# Altium schematic sheet esp32_pico_d4_motor_driver.SchDoc_2022-05-04 (1).schdoc
size 385 x 195 mm
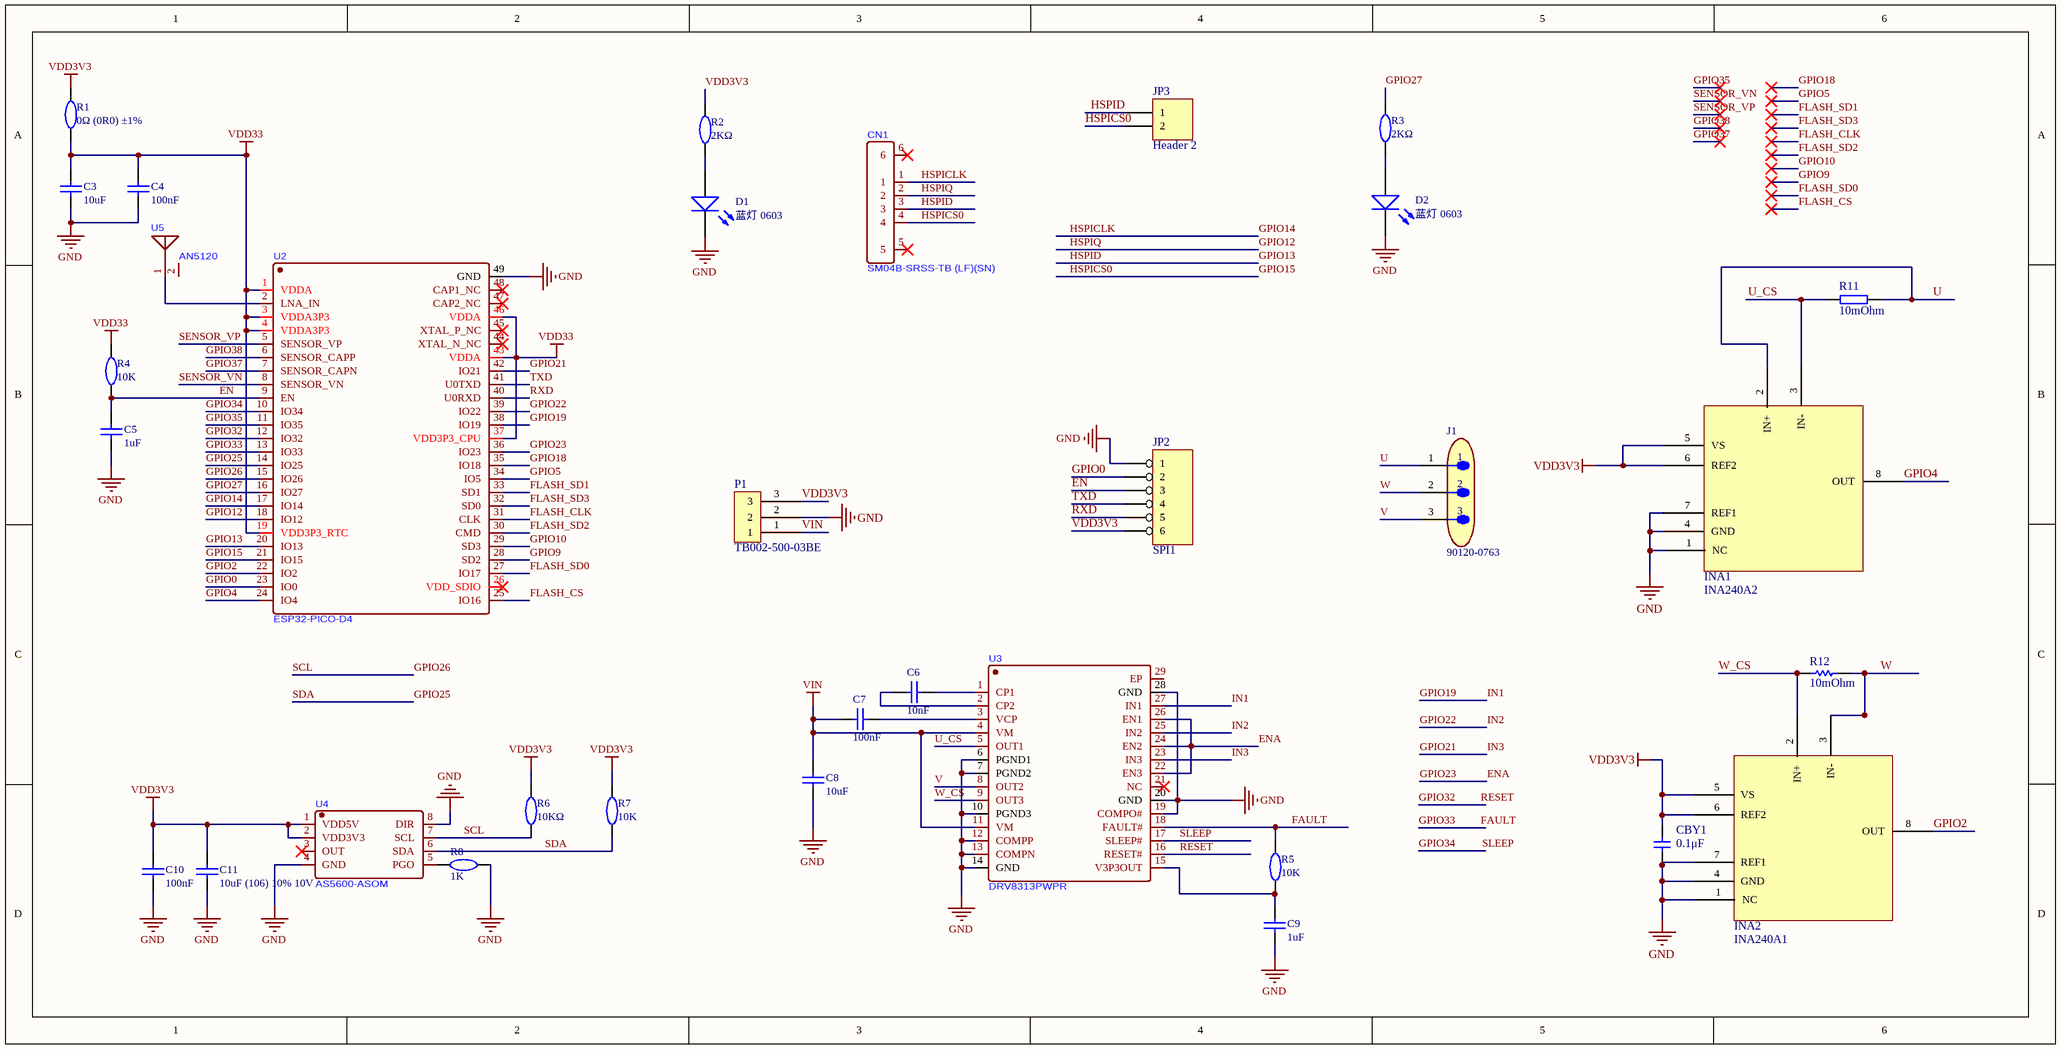
[diagram p0: esp32_pico_d4_motor_driver.SchDoc_2022-05-04 (1).schdoc]

## Parts
C3  10uF  [0603C]
C4  100nF  [0603C]
C5  1uF  [0603C]
C6  10nF  [0603C]
C7  100nF  [0603C]
C8  10uF  [0603C]
C9  1uF  [0603C]
C10  100nF  [0603C]
C11  10uF (106) 10% 10V  [0603C]
CBY1  0.1μF  [0603C]
CN1  SM04B-SRSS-TB (LF)(SN)  [CONN-SMD_4P-P1.00_SM04B-SRSS-TB-LF-SN]
D1  蓝灯 0603  [0603_diode]
D2  蓝灯 0603  [0603_diode]
INA1  INA240A2  [INA240]
INA2  INA240A1  [INA240]
J1  90120-0763  [10.7MHZ]
JP2  SPI1  [SHDR6]
JP3  Header 2  [SHDR2]
P1  TB002-500-03BE  [SHDR3]
R1  0Ω (0R0) ±1%  [0603R]
R2  2KΩ  [0603R]
R3  2KΩ  [0603R]
R4  10K  [0603R]
R5  10K  [0603R]
R6  10KΩ  [0603]
R7  10K  [0603R]
R8  1K  [0603]
R11  10mOhm  [RESC6332]
R12  10mOhm  [RESC6332]
U2  ESP32-PICO-D4  [QFN-48_L7.0-W7.0-P0.50-BL-EP5.4]
U3  DRV8313PWPR  [HTSSOP-28_L9.8-W4.5-P0.65-LS6.6-BL-EP]
U4  AS5600-ASOM  [SOIC-8_L5.0-W4.0-P1.27-LS6.0-BL]
U5  AN5120  [ANT-SMD_L5.5-W2.0]

## Nets
GND: C3.1 C4.1 C5.1 C8.1 C9.1 C10.1 C11.1 CBY1.2 D1.K D2.K INA1.1(NC) INA1.4(GND) INA1.7(REF1) INA2.1(NC) INA2.4(GND) INA2.7(REF1) JP2.1 P1.2 R8.2 U2.49(GND) U3.6(PGND1) U3.7(PGND2) U3.10(PGND3) U3.12(COMPP) U3.13(COMPN) U3.14(GND) U3.19(COMPO#) U3.20(GND) U3.28(GND) U4.4(GND) U4.8(DIR)
VDD3V3: C10.2 C11.2 CBY1.1 INA1.5(VS) INA1.6(REF2) INA2.5(VS) INA2.6(REF2) JP2.6 P1.3 R1.2 R2.2 R6.2 R7.2 U4.1(VDD5V) U4.2(VDD3V3)
VDD33: C3.2 C4.2 R1.1 R4.2 U2.1(VDDA) U2.3(VDDA3P3) U2.4(VDDA3P3) U2.19(VDD3P3_RTC) U2.37(VDD3P3_CPU) U2.43(VDDA) U2.46(VDDA)
VIN: C7.2 C8.2 P1.1 U3.4(VM) U3.11(VM)
EN: C5.2 JP2.3 R4.1 U2.9(EN)
ENA: U2.36(IO23) U3.22(EN3) U3.24(EN2) U3.26(EN1)  [also labelled GPIO23]
FAULT: R5.2 U2.13(IO33) U3.18(FAULT#)  [also labelled GPIO33]
FLASH_CLK: U2.31(CLK)
FLASH_CS: U2.25(IO16)
FLASH_SD0: U2.27(IO17)
FLASH_SD1: U2.33(SD1)
FLASH_SD2: U2.30(CMD)
FLASH_SD3: U2.32(SD0)
GPIO0: JP2.2 U2.23(IO0)
GPIO2: INA2.8(OUT) U2.22(IO2)
GPIO4: INA1.8(OUT) U2.24(IO4)
GPIO5: U2.34(IO5)
GPIO9: U2.28(SD2)
GPIO10: U2.29(SD3)
GPIO12: CN1.2 U2.18(IO12)  [also labelled HSPIQ]
GPIO13: CN1.3 JP3.2(1) U2.20(IO13)  [also labelled HSPID]
GPIO14: CN1.1 U2.17(IO14)  [also labelled HSPICLK]
GPIO15: CN1.4 JP3.1(2) U2.21(IO15)  [also labelled HSPICS0]
GPIO18: U2.35(IO18)
GPIO19: U2.38(IO19) U3.27(IN1)  [also labelled IN1]
GPIO21: U2.42(IO21) U3.23(IN3)  [also labelled IN3]
GPIO22: U2.39(IO22) U3.25(IN2)  [also labelled IN2]
GPIO25: R7.1 U2.14(IO25) U4.6(SDA)  [also labelled SDA]
GPIO26: R6.1 U2.15(IO26) U4.7(SCL)  [also labelled SCL]
GPIO27: R3.2 U2.16(IO27)
GPIO32: U2.12(IO32) U3.16(RESET#)  [also labelled RESET]
GPIO34: U2.10(IO34) U3.17(SLEEP#)  [also labelled SLEEP]
GPIO35: U2.11(IO35)
GPIO37: U2.7(SENSOR_CAPN)
GPIO38: U2.6(SENSOR_CAPP)
RXD: JP2.5 U2.40(U0RXD)
SENSOR_VN: U2.8(SENSOR_VN)
SENSOR_VP: U2.5(SENSOR_VP)
TXD: JP2.4 U2.41(U0TXD)
U: INA1.2(IN+) J1.1 R11.2
U_CS: INA1.3(IN-) R11.1 U3.5(OUT1)
V: J1.3 U3.8(OUT2)
W: INA2.3(IN-) J1.2 R12.2
W_CS: INA2.2(IN+) R12.1 U3.9(OUT3)
NetC6_1: C6.1 U3.2(CP2)
NetC6_2: C6.2 U3.1(CP1)
NetC7_1: C7.1 U3.3(VCP)
NetC9_2: C9.2 R5.1 U3.15(V3P3OUT)
NetD1_A: D1.A R2.1
NetD2_A: D2.A R3.1
NetR8_1: R8.1 U4.5(PGO)
NetU2_2: U2.2(LNA_IN) U5.1

Not connected (* = marked no-connect by the designer): CN1 5* 6*; U2 26(VDD_SDIO)* 44(XTAL_N_NC)* 45(XTAL_P_NC)* 47(CAP2_NC)* 48(CAP1_NC)*; U3 21(NC)* 29(EP); U4 3(OUT)*; U5 2(NC)

## Library data of the parts
CBY1 = CAP_1
INA1 INA2 = INA240: Supplier 1: Mouser; Supplier Part Number 1: 595-INA240A2PWR
J1 = 90120-0763: Manufacturer: Molex; Voltage Rating: 350V; Number Of Contacts: 3; Conn Orientation: Vertical; Current Rating: 3A; Pitch: 2.54mm; Conn Gender: Male; ComponentLink2Description: Datasheet; Height: 5.8mm; Manufacturer Part Number: 90120-0763; Temperature Range High: +125°C; RoHS: TRUE; ComponentLink2URL: https://www.molex.com/webdocs/datasheets/pdf/en-us/0901200763_PCB_HEADERS.pdf; Device Class L2: Headers and Wire Housings; Temperature: -55°C to +125°C; Device Class L1: Connectors; Footprint Url: https://www.molex.com/pdm_docs/sd/901200763_sd.pdf; Device Class L3: unset; Temperature Range Low: -55°C; Number Of Rows: 1; Category: Conn; Lead Free: Yes; Mouser Description: Board-To-Board Connector, C-Grid III 90120 Series, Through Hole, Header, 3, 2.54 mm; Octopart: https://octopart.com/90120-0763-molex-655433; Contact Material: Gold,Nickel; Automotive: No; Digikey Description: CONN HEADER VERT 3POS 2.54MM
JP2 = HEADER 6
JP3 = Header 2: Header, 2-Pin; LatestRevisionDate: 17-Jul-2002; LatestRevisionNote: Re-released for DXP Platform.; Publisher: Altium Limited
R11 = RES2
R12 = Res1: Resistor; Value: 1K; Ordered by: Subcon; Published: 8-Jun-2000; Revision: July-2002: Re-released for DXP Platform.; Publisher: Altium Limited
C3 C8 = 10uF: ComponentLink1Description: 供应商链接; ComponentLink1URL: http://www.szlcsc.com/product/details_20411.html; Supplier: LC; SuppliersPartNumber: C19702
C4 C7 C10 = 100nF: ComponentLink1Description: 供应商链接; ComponentLink1URL: http://www.szlcsc.com/product/details_15331.html; Supplier: LC; SuppliersPartNumber: C14663
C5 C9 = 1uF: ComponentLink1Description: 供应商链接; ComponentLink1URL: http://www.szlcsc.com/product/details_16531.html; Supplier: LC; SuppliersPartNumber: C15849
C6 = 10nF: ComponentLink1Description: 供应商链接; ComponentLink1URL: http://www.szlcsc.com/product/details_58143.html; Supplier: LC; SuppliersPartNumber: C57112
C11 = 10uF (106) 10% 10V: ComponentLink1Description: 供应商链接; ComponentLink1URL: http://www.szlcsc.com/product/details_20411.html; Supplier: LC; SuppliersPartNumber: C19702
D1 D2 = 蓝灯 0603: ComponentLink1Description: 供应商链接; ComponentLink1URL: http://www.szlcsc.com/product/details_73150.html; Supplier: LC; SuppliersPartNumber: C72041
P1 = TB002-500-03BE: Supplier 1: Mouser; Supplier Part Number 1: 490-TB002-500-03BE
R1 = 0Ω (0R0) ±1%: ComponentLink1Description: 供应商链接; ComponentLink1URL: http://www.szlcsc.com/product/details_21903.html; Supplier: LC; SuppliersPartNumber: C21189
R2 R3 = 2KΩ: ComponentLink1Description: 供应商链接; ComponentLink1URL: http://www.szlcsc.com/product/details_23702.html; Supplier: LC; SuppliersPartNumber: C22975
R4 R5 R7 = 10K: ComponentLink1Description: 供应商链接; ComponentLink1URL: http://www.szlcsc.com/product/details_26547.html; Supplier: LC; SuppliersPartNumber: C25804
R6 = 10KΩ: ComponentLink1Description: 供应商链接; ComponentLink1URL: http://www.szlcsc.com/product/details_26547.html; Supplier: LC; SuppliersPartNumber: C25804
R8 = 1K: ComponentLink1Description: 供应商链接; ComponentLink1URL: http://www.szlcsc.com/product/details_21904.html; Supplier: LC; SuppliersPartNumber: C21190